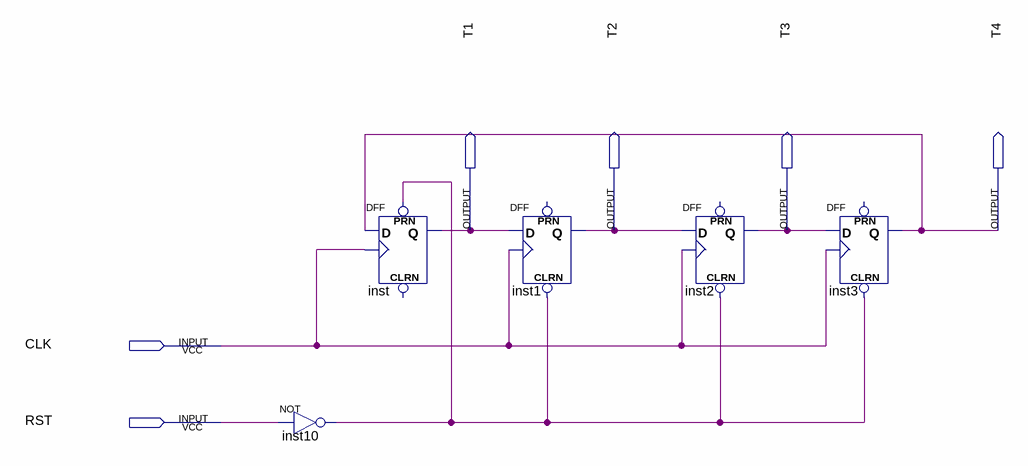
[diagram p0: schematic sheet]
// Quartus schematic step.bdf as structural Verilog: 5 symbols, 6 pins
module step (
  input  CLK,
  input  RST,
  output T1,
  output T2,
  output T3,
  output T4
);

  wire inst10_out;

  not inst10 (inst10_out, RST);
  DFF inst (.CLK(CLK), .D(T4), .PRN(inst10_out), .Q(T1));  // open: CLRN
  DFF inst1 (.CLRN(inst10_out), .CLK(CLK), .D(T1), .Q(T2));  // open: PRN
  DFF inst2 (.CLRN(inst10_out), .CLK(CLK), .D(T2), .Q(T3));  // open: PRN
  DFF inst3 (.CLRN(inst10_out), .CLK(CLK), .D(T3), .Q(T4));  // open: PRN
endmodule
